# Altium project Encoder.PrjPcb
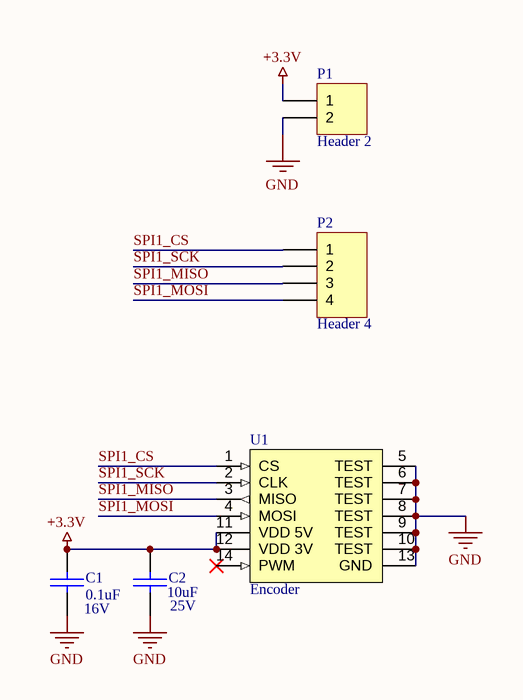
[diagram p0: Encoder.SchDoc]
1 sheet, 5 parts. Net scope: global (net labels, ports and power ports of the same name join across sheets).
Board file: Encoder.PcbDoc

## Sheet Encoder.SchDoc: Наименование
size 420 x 297 mm; Author: Барсегян К.Р.; CompanyName: BRT; SheetNumber: 1; SheetTotal: 1; PageSetup: Record=PageOptions|CenterHorizontal=True|CenterVertical=True|PrintScale=0.94|XCorrection=1.00|YCorrection=1.00|PrintKind=1|BorderSize=5000000|LeftOffset=0|BottomOffset=0|Orientation=1|PaperLength=1000|PaperWidth=1000|Scale=100|PaperSource=7|PrintQuality=-4|MediaType=1|DitherType=10|PaperKind=A4|PrintScaleMode=1; Name: Наименование; DocumentName: Sheet1.SCHDOC

### Parts
C1  0.1uF  Voltage: 16V  [0603 Capicator]
C2  10uF  Voltage: 25V  [0603 Capicator]
P1  Header 2  [HDR1X2]
P2  Header 4  [HDR1X4]
U1  Encoder  [TSSOP-14]

### Nets
+3.3V: C1.1 C2.1 P1.1 U1.11(VDD_5V) U1.12(VDD_3V)
GND: C1.2 C2.2 P1.2 U1.5(TEST) U1.6(TEST) U1.7(TEST) U1.8(TEST) U1.9(TEST) U1.10(TEST) U1.13(GND)
SPI1_CS: P2.1 U1.1(CS)
SPI1_MISO: P2.3 U1.3(MISO)
SPI1_MOSI: P2.4 U1.4(MOSI)
SPI1_SCK: P2.2 U1.2(CLK)

Not connected (* = marked no-connect by the designer): U1 14(PWM)*

### Notes on the sheet
- THIS DOCUMENT AND THE DATA DISCLOSED HEREIN OR
- HEREWITH IS THE PROPERTY OF ALTIUM LIMITED AND MAY
- DWG NO:
- REVISION
- REV:
- DESCRIPTION
- DATE
- APPROVED
- BE FREELY DISTRIBUTED IN WHOLE. NO RIGHTS ARE
- RESERVED OR EXPRESS OR IMPLIED WARANTEE GIVEN.
- ENG:
- APPROVALS
- PROJECT
- DSN:
- CHK:
- REFERENCE DOCUMENTS
- PROJECT REVISION:
- TITLE
- DOCUMENT REVISION:
- DESIGN ITEM:
- BOM:
- FAB DWG:
- PCB DWG:
- ASSY DWG:
- SCALE:
- A3
- SIZE
- CAGE CODE
- FILE NAME
- DWG NO.
- SHEET
- OF
- REV

### Library data of the parts
C1 = Cap 0.1uF (0603): 0.1uF X7R 16V 10% 0603; Manufacturer: Murata Manufacturing; Part Number: GRM188R71C104KA01D; Type: Capacitor; ComponentLink1Description: Chip&Dip; ComponentLink1URL: https://www.chipdip.ru/product/grm188r71c104ka01d
C2 = Cap 10uF (0603): 10uF X5R 25V 20% 0603; Manufacturer: Murata Manufacturing; Part Number: GRM188R61E106M; Type: Capacitor; ComponentLink1Description: Chip&Dip; ComponentLink1URL: https://www.chipdip.ru/product/grm188r61e106m
P1 = Header 2: Header, 2-Pin; LatestRevisionDate: 17-Jul-2002; LatestRevisionNote: Re-released for DXP Platform.; Publisher: Altium Limited
P2 = Header 4: Header, 4-Pin; LatestRevisionDate: 17-Jul-2002; LatestRevisionNote: Re-released for DXP Platform.; Publisher: Altium Limited
U1 = Encoder: Magnetic Rotary Encoder; Part Number: AS5048A; Manufacturer: ams; ComponentLink1Description: DataSheet; ComponentLink1URL: https://www.mouser.com/ds/2/588/AS5048_DS000298_3-00-522551.pdf; Type: IC